# Altium project PCB_Project1.PrjPCB
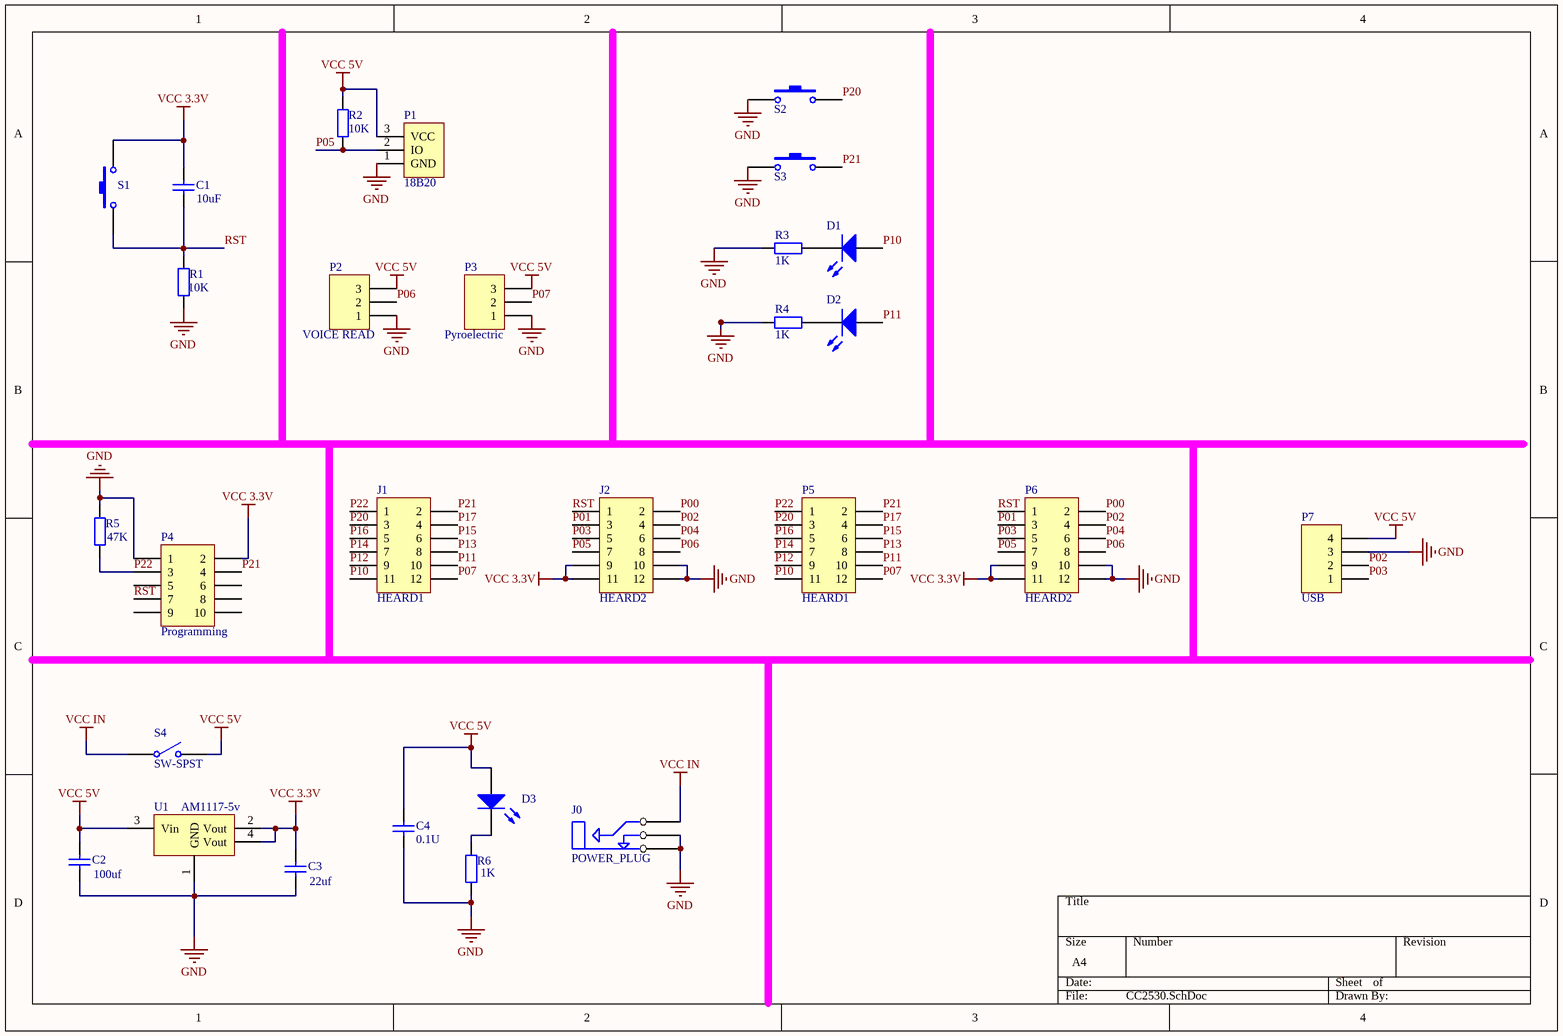
[diagram p0: CC2530.SchDoc]
1 sheet, 28 parts. Net scope: global (net labels, ports and power ports of the same name join across sheets).
Board file: CC2530.PcbDoc

## Sheet CC2530.SchDoc
size A4

### Parts
C1  value 10uF  [0805C]  (hidden comment: Cap)
C2  value 100uf  [0805C]  (hidden comment: Cap)
C3  value 22uf  [0805C]  (hidden comment: Cap)
C4  value 0.1U  [0805C]  (hidden comment: Cap)
D1  LED2  [0805D]  (value not drawn)
D2  LED2  [0805D]  (value not drawn)
D3  LED2  [0805D]  (value not drawn)
J0  POWER_PLUG  [POWC]
J1  HEARD1  [HDR2X6]
J2  HEARD2  [HDR2X6]
P1  18B20  [HDR1X3]
P2  VOICE READ  [HDR1X3]
P3  Pyroelectric  [HDR1X3]
P4  Programming  [HDR2X5]
P5  HEARD1  [HDR2X6]
P6  HEARD2  [HDR2X6]
P7  USB  [HDR1X4]
R1  value 10K  [0805]  (hidden comment: Res2)
R2  value 10K  [0805]  (hidden comment: Res2)
R3  value 1K  [0805]  (hidden comment: es2)
R4  value 1K  [0805]  (hidden comment: es2)
R5  value 47K  [0805]  (hidden comment: Res2)
R6  value 1K  [0805]  (hidden comment: Res2)
S1  SW-PB  [SW-PUSH]  (value not drawn)
S2  SW-PB  [SW-PUSH]  (value not drawn)
S3  SW-PB  [SW-PUSH]  (value not drawn)
S4  SW-SPST  [HDR1X3]
U1  AM1117-5v  [SOT223]

### Nets
GND: C2.1 C3.1 C4.1 J0.2 J0.3 J2.10 J2.12 P1.1(GND) P2.1 P3.1 P4.1 P6.10 P6.12 P7.3 R1.1 R3.1 R4.1 R5.2 R6.1 S2.1 S3.1 U1.1(GND)
VCC 3.3V: C1.2 C3.2 J2.9 J2.11 P4.2 P6.9 P6.11 S1.2 U1.2(Vout) U1.4(Vout)
VCC 5V: C2.2 C4.2 D3.A P1.3(VCC) P2.3 P3.3 P7.4 R2.2 S4.2(NO) U1.3(Vin)
VCC IN: J0.1 S4.1(COMMON)
P00: J2.2 P6.2
P01: J2.3 P6.3
P02: J2.4 P6.4 P7.2
P03: J2.5 P6.5 P7.1
P04: J2.6 P6.6
P05: J2.7 P1.2(IO) P6.7 R2.1
P06: J2.8 P2.2 P6.8
P07: J1.12 P3.2 P5.12
P10: D1.A J1.11 P5.11
P11: D2.A J1.10 P5.10
P12: J1.9 P5.9
P13: J1.8 P5.8
P14: J1.7 P5.7
P15: J1.6 P5.6
P16: J1.5 P5.5
P17: J1.4 P5.4
P20: J1.3 P5.3 S2.2
P21: J1.2 P4.4 P5.2 S3.2
P22: J1.1 P4.3 P5.1 R5.1
RST: C1.1 J2.1 P4.7 P6.1 R1.2 S1.1
NetD1_K: D1.K R3.2
NetD2_K: D2.K R4.2
NetD3_K: D3.K R6.2

Not connected (* = marked no-connect by the designer): P4 5 6 8 9 10

### Library data of the parts
C1-C4 = Cap: Capacitor; Published: 8-Jun-2000; LatestRevisionDate: 17-Jul-2002; LatestRevisionNote: Re-released for DXP Platform.; PackageReference: RAD-0.3; Publisher: Altium Limited
  C2 C3: PackageDescription: Radial Cap, Thru-Hole; 2 Leads; 0.3 in Pin Spacing
D1-D3 = LED2: Typical RED, GREEN, YELLOW, AMBER GaAs LED; Published: 8-Jun-2000; LatestRevisionDate: 17-Jul-2002; LatestRevisionNote: Re-released for DXP Platform.; PackageDocument: Feb-2002; PackageReference: 3.2X1.6X1.1; Publisher: Altium Limited
J1 J2 P5 P6 = MHDR2X6: Header, 6-Pin, Dual row; LatestRevisionDate: 17-Jul-2002; LatestRevisionNote: Re-released for DXP Platform.; Publisher: Altium Limited
P1 = Header 3H: Header, 3-Pin, Right Angle; LatestRevisionDate: 17-Jul-2002; LatestRevisionNote: Re-released for DXP Platform.; Publisher: Altium Limited
P2 P3 = Header 3: Header, 3-Pin; LatestRevisionDate: 17-Jul-2002; LatestRevisionNote: Re-released for DXP Platform.; Publisher: Altium Limited
P4 = Header 5X2: Header, 5-Pin, Dual row; LatestRevisionDate: 17-Jul-2002; LatestRevisionNote: Re-released for DXP Platform.; Publisher: Altium Limited
P7 = Header 4: Header, 4-Pin; LatestRevisionDate: 17-Jul-2002; LatestRevisionNote: Re-released for DXP Platform.; Publisher: Altium Limited
R1-R6 = Res2: Resistor; Published: 8-Jun-2000; LatestRevisionDate: 17-Jul-2002; LatestRevisionNote: Re-released for DXP Platform.; PackageReference: AXIAL-0.4; Publisher: Altium Limited
  R5: PackageDescription: Axial Device, Thru-Hole; 2 Leads; 0.4 in Pin Spacing
S1-S3 = SW-PB: Switch; Published: 24-Mar-1999; LatestRevisionDate: 17-Jul-2002; LatestRevisionNote: Re-released for DXP Platform.; PackageReference: SPST-2; Publisher: Altium Limited
S4 = SW-SPST: Single-Pole, Single-Throw Switch; Published: 24-Mar-1999; LatestRevisionDate: 17-Jul-2002; LatestRevisionNote: Re-released for DXP Platform.; PackageReference: SPST-2; Publisher: Altium Limited
U1 = LT1085